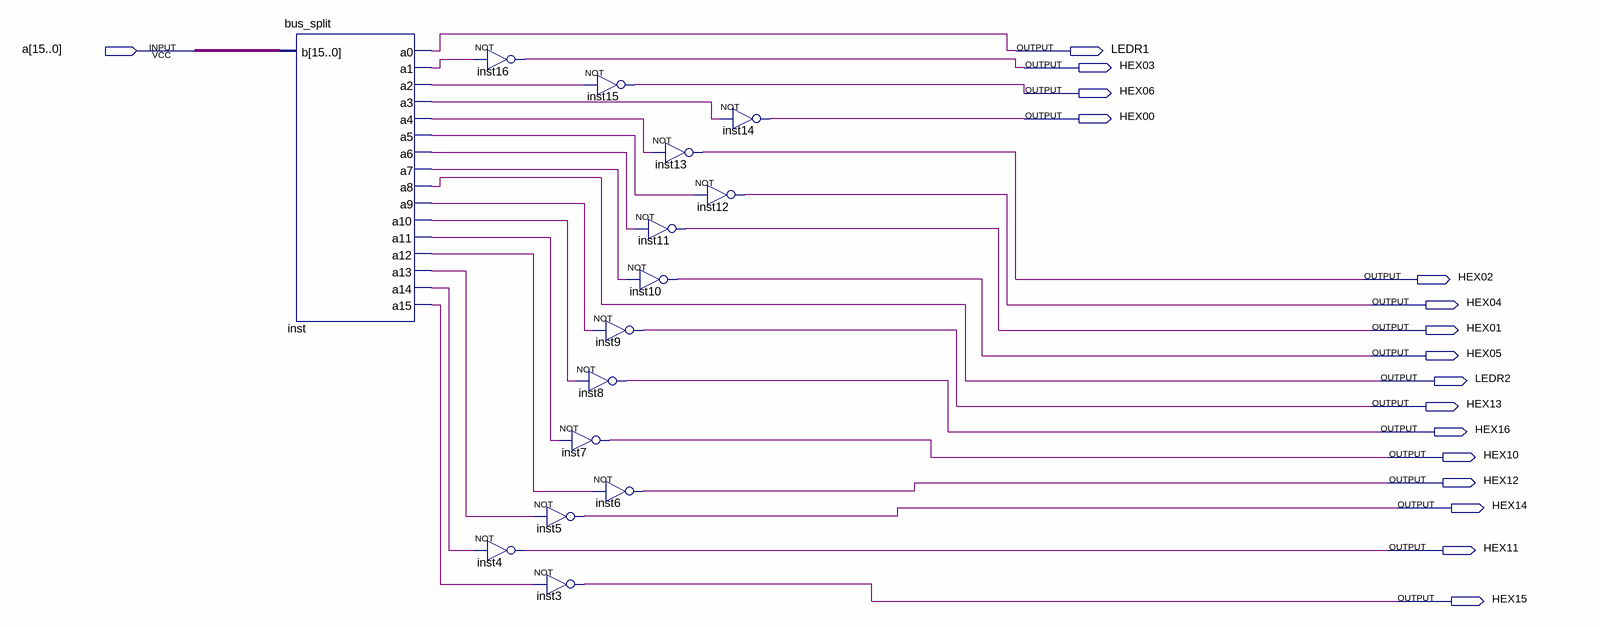
[diagram p0: schematic sheet]
// Quartus schematic display0.bdf as structural Verilog: 15 symbols, 17 pins
module display0 (
  input  [15:0] a,
  output LEDR1,
  output HEX03,
  output HEX06,
  output HEX00,
  output HEX02,
  output HEX04,
  output HEX01,
  output HEX05,
  output LEDR2,
  output HEX13,
  output HEX16,
  output HEX10,
  output HEX12,
  output HEX14,
  output HEX11,
  output HEX15
);

  wire inst_a1, inst_a2, inst_a3, inst_a4, inst_a5, inst_a6, inst_a7, inst_a9, inst_a10, inst_a11, inst_a12,
       inst_a13, inst_a14, inst_a15;

  bus_split inst (
    .b(a), .a0(LEDR1), .a1(inst_a1), .a2(inst_a2), .a3(inst_a3), .a4(inst_a4), .a5(inst_a5), .a6(inst_a6),
    .a7(inst_a7), .a8(LEDR2), .a9(inst_a9), .a10(inst_a10), .a11(inst_a11), .a12(inst_a12), .a13(inst_a13),
    .a14(inst_a14), .a15(inst_a15));
  not inst16 (HEX03, inst_a1);
  not inst4 (HEX11, inst_a14);
  not inst15 (HEX06, inst_a2);
  not inst9 (HEX13, inst_a9);
  not inst8 (HEX16, inst_a10);
  not inst7 (HEX10, inst_a11);
  not inst6 (HEX12, inst_a12);
  not inst5 (HEX14, inst_a13);
  not inst3 (HEX15, inst_a15);
  not inst13 (HEX02, inst_a4);
  not inst11 (HEX01, inst_a6);
  not inst10 (HEX05, inst_a7);
  not inst14 (HEX00, inst_a3);
  not inst12 (HEX04, inst_a5);
endmodule
